# Altium project PCB.PrjPcb
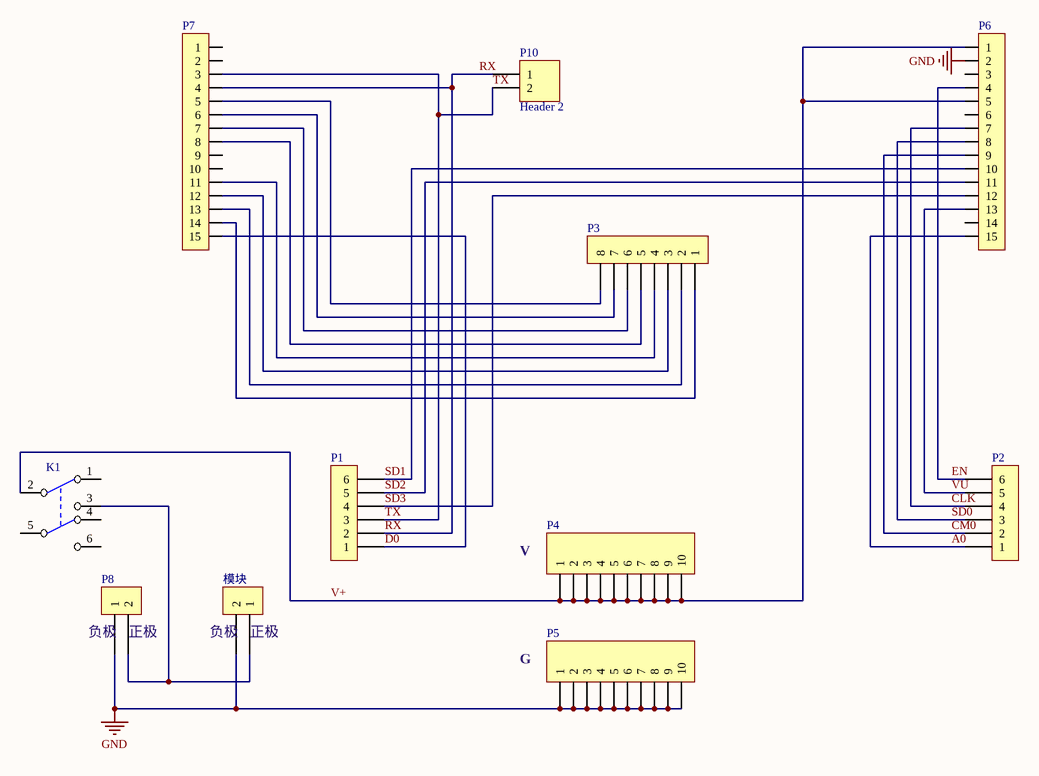
[diagram p0: 原理图.SchDoc]
1 sheet, 11 parts. Net scope: global (net labels, ports and power ports of the same name join across sheets).

## Sheet 原理图.SchDoc
size A4

### Parts
K1  (no value)  [K-7*7mm]
P1  (no value)  [SIP6]
P2  (no value)  [SIP6]
P3  (no value)  [SIP8]
P4  (no value)  [SIP10]
P5  (no value)  [SIP10]
P6  (no value)  [SIP15]
P7  (no value)  [SIP15]
P8  (no value)  [DIP2]
P9  模块  [SIP2]
P10  Header 2  [HDR1X2]

### Nets
GND: P5.1 P5.2 P5.3 P5.4 P5.5 P5.6 P5.7 P5.8 P5.9 P5.10 P6.2 P8.1 P9.2
A0: P2.1 P6.15
CLK: P2.4 P6.7
CM0: P2.2 P6.9
D0: P1.1 P7.15
EN: P2.6 P6.4
RX: P1.2 P7.4 P10.1
SD0: P2.3 P6.8
SD1: P1.6 P6.10
SD2: P1.5 P6.11
SD3: P1.4 P6.12
TX: P1.3 P7.3 P10.2
V+: K1.2 P4.1 P4.2 P4.3 P4.4 P4.5 P4.6 P4.7 P4.8 P4.9 P4.10 P6.1 P6.5
VU: P2.5 P6.13
NetK1_3: K1.3 P8.2 P9.1
NetP3_1: P3.1 P7.14
NetP3_2: P3.2 P7.13
NetP3_3: P3.3 P7.12
NetP3_4: P3.4 P7.11
NetP3_5: P3.5 P7.8
NetP3_6: P3.6 P7.7
NetP3_7: P3.7 P7.6
NetP3_8: P3.8 P7.5

Not connected (* = marked no-connect by the designer): K1 1 4 5 6; P6 3 6 14; P7 1 2 9 10

### Notes on the sheet
- (near P4) V
- (near P8) 负极
- (near P8) 正极
- (near P9) 负极
- (near P9) 正极
- (near P5) G
- Title
- Size:
- Date:
- File:
- A0
- Number:
- Time:
- Revision:
- Sheet
- of

### Library data of the parts
K1 = SW-DPDT: 双刀双执开关
P1 P2 = 6P
P3 = 8P
P4 P5 = 10P
P6 P7 = 15P
P8 P9 = CON1
P10 = Header 2: Header, 2-Pin; LatestRevisionDate: 17-Jul-2002; LatestRevisionNote: Re-released for DXP Platform.; Publisher: Altium Limited